# EAGLE design atmega8_bare_bones (EAGLE 5.07)
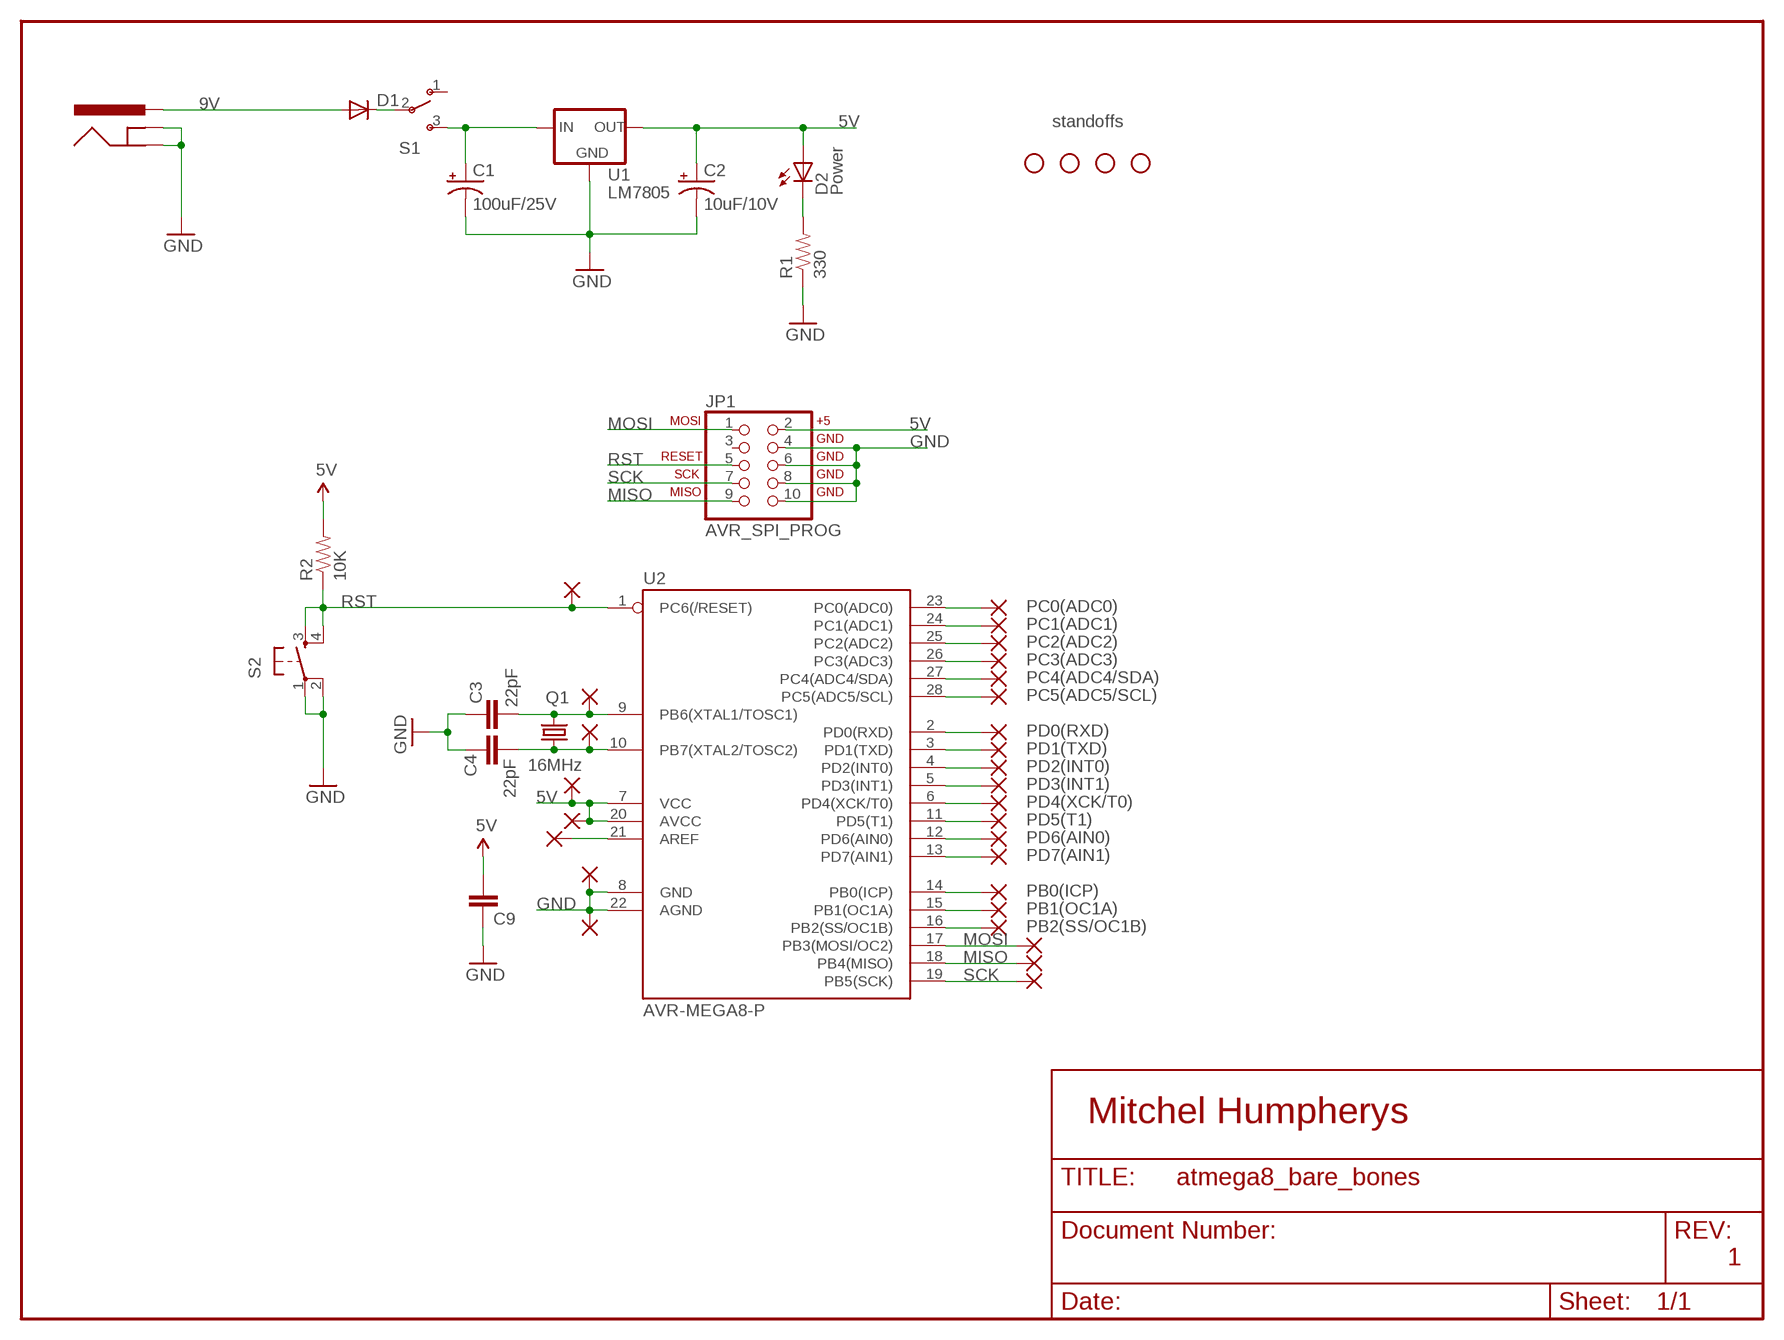
[diagram p0: schematic, sheet 1]

## Parts
C1  100uF/25V  CAP_POLPTH2  [CPOL-RADIAL-10UF-25V]
C2  10uF/10V  CAP_POLPTH2  [CPOL-RADIAL-10UF-25V]
C3  22pF  CAPPTH  [CAP-PTH-SMALL]
C4  22pF  CAPPTH  [CAP-PTH-SMALL]
C9  0.1uF  CAPPTH  [CAP-PTH-SMALL]
D1  DIODEPTH  [DIODE-0.4]
D2  Power  LED5MM  [LED5MM]
JP1  AVR_SPI_PROG  [AVR_ICSP]
JP2  STAND-OFF  [STAND-OFF]
JP3  STAND-OFF  [STAND-OFF]
JP4  STAND-OFF  [STAND-OFF]
JP5  STAND-OFF  [STAND-OFF]
PAD1  2,15/1,0  [2,15/1,0]
PAD2  2,15/1,0  [2,15/1,0]
PAD3  2,15/1,0  [2,15/1,0]
PAD4  2,15/1,0  [2,15/1,0]
PAD5  2,15/1,0  [2,15/1,0]
PAD6  2,15/1,0  [2,15/1,0]
PAD7  2,15/1,0  [2,15/1,0]
PAD8  2,15/1,0  [2,15/1,0]
PAD9  2,15/1,0  [2,15/1,0]
PAD10  2,15/1,0  [2,15/1,0]
PAD18  2,15/1,0  [2,15/1,0]
PB0(ICP)  2,15/1,0  [2,15/1,0]
PB1(OC1A)  2,15/1,0  [2,15/1,0]
PB2(SS/OC1B)  2,15/1,0  [2,15/1,0]
PC0(ADC0)  2,15/1,0  [2,15/1,0]
PC1(ADC1)  2,15/1,0  [2,15/1,0]
PC2(ADC2)  2,15/1,0  [2,15/1,0]
PC3(ADC3)  2,15/1,0  [2,15/1,0]
PC4(ADC4/SDA)  2,15/1,0  [2,15/1,0]
PC5(ADC5/SCL)  2,15/1,0  [2,15/1,0]
PD0(RXD)  2,15/1,0  [2,15/1,0]
PD1(TXD)  2,15/1,0  [2,15/1,0]
PD2(INT0)  2,15/1,0  [2,15/1,0]
PD3(INT1)  2,15/1,0  [2,15/1,0]
PD4(XCK/T0)  2,15/1,0  [2,15/1,0]
PD5(T1)  2,15/1,0  [2,15/1,0]
PD6(AIN0)  2,15/1,0  [2,15/1,0]
PD7(AIN1)  2,15/1,0  [2,15/1,0]
Q1  16MHz  CRYSTALHC49US  [HC49US]
R1  330  RESISTORPTH1  [AXIAL-0.3]
R2  10K  RESISTORPTH1  [AXIAL-0.3]
S1  SWITCH-SPST  [SWITCH-SPST]
S2  Reset  TAC_SWITCHPTH  [TACTILE-PTH]
U1  LM7805  V_REG_78XXSINK  [TO220-IGO]
U2  AVR-MEGA8-P  [DIL28-3]
U$1  POWER_JACKPTH  [POWER_JACK_PTH]
U$2  MITCH_SIG  [MITCH_SIG]

## Nets
5V: C2.1(+) D2.A JP1.2 PAD4.1(P) PAD10.1(P) U1.OUT U2.7(VCC) U2.20(AVCC)
9V: D1.A U$1.PWR
9V2: C1.1(+) S1.3(S) U1.IN
GND: C1.2(-) C2.2(-) C3.1 C4.1 C9.1 JP1.4 JP1.6 JP1.8 JP1.10 PAD5.1(P) PAD6.1(P) R1.P$1 S2.1 S2.2 U1.GND U2.8(GND) U2.22(AGND) U$1.GND U$1.GNDBREAK
MISO: JP1.9 PAD8.1(P) U2.18(PB4(MISO))
MOSI: JP1.1 PAD7.1(P) U2.17(PB3(MOSI/OC2))
N$1: D1.C S1.2(P)
N$2: D2.K(C) R1.P$2
N$3: PC0(ADC0).1(P) U2.23(PC0(ADC0))
N$4: PC1(ADC1).1(P) U2.24(PC1(ADC1))
N$5: C3.2 PAD2.1(P) Q1.2 U2.9(PB6(XTAL1/TOSC1))
N$6: C4.2 PAD3.1(P) Q1.1 U2.10(PB7(XTAL2/TOSC2))
N$7: PC2(ADC2).1(P) U2.25(PC2(ADC2))
N$8: PC3(ADC3).1(P) U2.26(PC3(ADC3))
N$9: PC4(ADC4/SDA).1(P) U2.27(PC4(ADC4/SDA))
N$10: PC5(ADC5/SCL).1(P) U2.28(PC5(ADC5/SCL))
N$11: PD0(RXD).1(P) U2.2(PD0(RXD))
N$12: PD1(TXD).1(P) U2.3(PD1(TXD))
N$13: PD2(INT0).1(P) U2.4(PD2(INT0))
N$14: PD3(INT1).1(P) U2.5(PD3(INT1))
N$15: PD4(XCK/T0).1(P) U2.6(PD4(XCK/T0))
N$16: PD5(T1).1(P) U2.11(PD5(T1))
N$17: PD6(AIN0).1(P) U2.12(PD6(AIN0))
N$18: PD7(AIN1).1(P) U2.13(PD7(AIN1))
N$19: PB0(ICP).1(P) U2.14(PB0(ICP))
N$20: PB1(OC1A).1(P) U2.15(PB1(OC1A))
N$21: PB2(SS/OC1B).1(P) U2.16(PB2(SS/OC1B))
N$22: PAD18.1(P) U2.21(AREF)
RST: JP1.5 PAD1.1(P) R2.P$1 S2.3 S2.4 U2.1(PC6(/RESET))
SCK: JP1.7 PAD9.1(P) U2.19(PB5(SCK))
VCC: C9.2 R2.P$2 ; supply symbol labelled 5V
Unconnected: JP1.3 S1.1(O)

## Notes on the sheet
- standoffs
- 1

## Library data of the parts
C1 C2 = SparkFun:CAP_POL: Capacitor Polarized These are standard SMD and PTH capacitors. Normally 10uF, 47uF, and 100uF in electrolytic and tantalum varieties. Always verify the external diameter of the through hole cap, it varies with capacity, voltage, and manufacturer. The EIA devices should be standard.
C3 C4 C9 = SparkFun:CAP: Capacitor Standard 0603 ceramic capacitor, and 0.1" leaded capacitor.
D1 = SparkFun:DIODE: Diode These are standard reverse protection diodes and small signal diodes. SMA package can handle up to about 1A. SOD-323 can handle about 200mA. What the SOD-323 package when ordering, there are some mfgs out there that are 5-pin packages.
D2 = SparkFun:LED: LEDs Standard schematic elements and footprints for 5mm, 3mm, 1206, and 0603 sized LEDs. 5mm - Spark Fun Electronics SKU : Comp-SBL
JP1 = SparkFun:AVR_SPI_PROG: AVR ICSP Header This is the standard AVR In Circuit Serial Programming header. Minimal, but includes pin one indicator. Works with standard Olimex programmers. Also look for the 6-pin reduced version.
JP2-JP5 = SparkFun:STAND-OFF: Stand Off This is the mechanical footprint for a #4 phillips button head screw. Use the keepout ring to avoid running the screw head into surrounding components. SKU : PRT-00447
PAD1-PAD10 PAD18 PB0(ICP) PB1(OC1A) PB2(SS/OC1B) PC0(ADC0) PC1(ADC1) PC2(ADC2) PC3(ADC3) PC4(ADC4/SDA) PC5(ADC5/SCL) PD0(RXD) PD1(TXD) PD2(INT0) PD3(INT1) PD4(XCK/T0) PD5(T1) PD6(AIN0) PD7(AIN1) = wirepad:2,15/1,0: THROUGH-HOLE PAD
Q1 = SparkFun:CRYSTAL: Crystals Various standard crystals. Proven footprints. Spark Fun Electronics SKU : Comp-XTAL
R1 R2 = SparkFun:RESISTOR: Resistor Basic schematic elements and footprints for 0603, 1206, and PTH 1/10th watt (small) resistors.
S1 = SparkFun:SWITCH-SPST: SPST Switch Simple slide switch. Spark Fun Electronics SKU : Comp-SW1
S2 = SparkFun:TAC_SWITCH: Momentary Switch Button commonly used for reset or general input. Spark Fun Electronics SKU : Comp-PBS
U1 = SparkFun:V_REG_78XX: Voltage Regulator Standard 7805 5V regulator. IGO (Input Ground Output). Spark Fun Electronics SKU : IC-VReg-5V
U2 = SparkFun:AVR-MEGA8-P: MICROCONTROLLER 8 Kbytes FLASH 1 kbytes SRAM 512 bytes EEPROM USART 4-channel 10 bit ADC 2-channel 8 bit ADC
U$1 = SparkFun:POWER_JACK: Power Jack This is the standard 5.5mm barrel jack for power. The PTH is the most common, proven, reliable, footprint. All others are experimental. The Slot footprint only works if the mill layer is transmitted to the PCB fab house so be warned. Spark Fun Electronics SKU : PType-BPJ. Mating wall wart : Tools-PS
U$2 = mitch_feaster:MITCH_SIG: My signature!

## Net classes
0 default: width 0.254 mm
1 power: width 0.508 mm

## Board
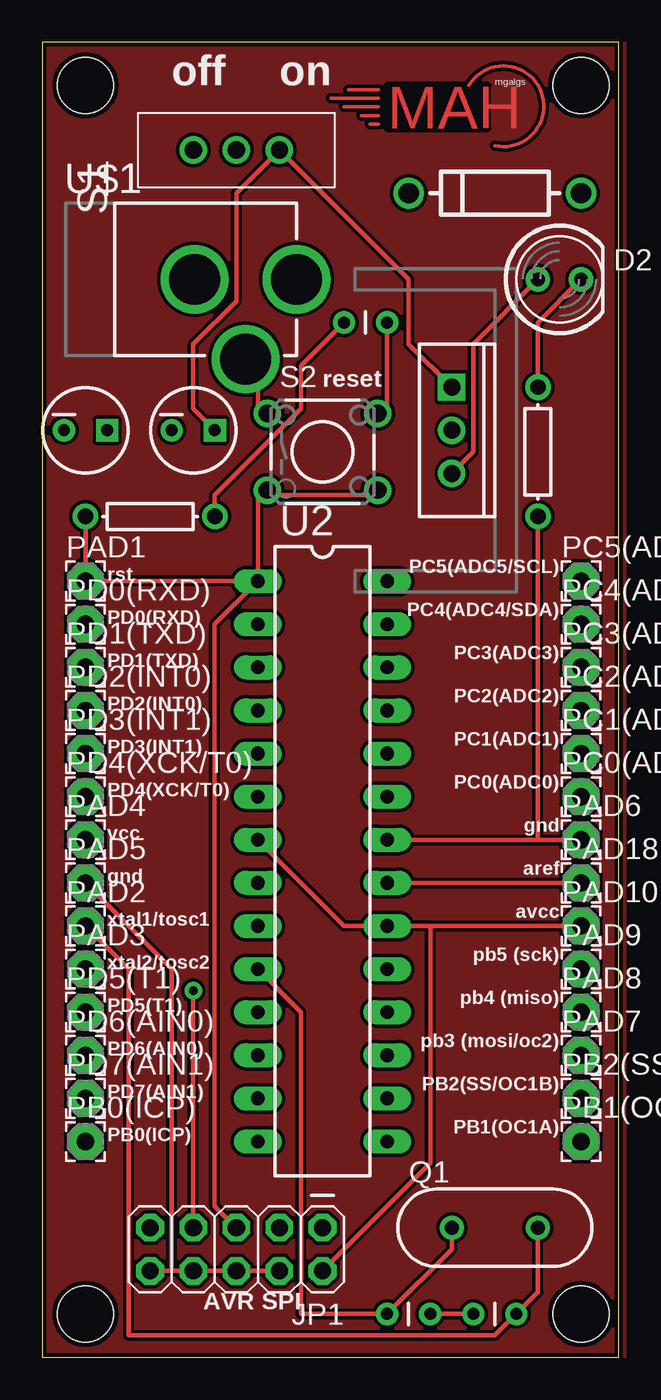
[diagram p1: board, top side]
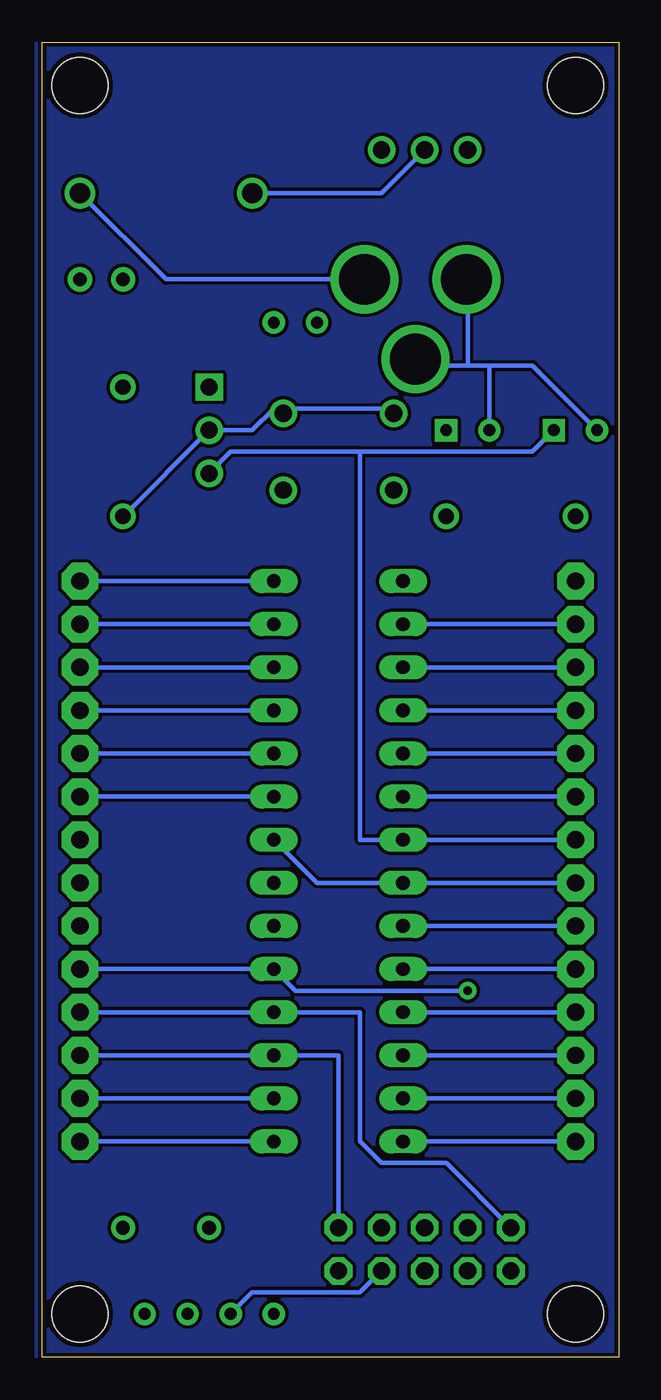
[diagram p2: board, bottom side, seen from below]

Size 33.96 x 77.46 mm. Coordinates in mm from the lower left corner, seen from the top.
Outline: 0,0 33.96,0 33.96,77.46 0,77.46 0,0
Copper layers (1*16): Top 0.035mm / dielectric 1.5mm / Bottom 0.035mm
Design rules "SparkFun": minimum track width 8mil, minimum drill 20mil, track to track 8mil, track to pad 8mil, pad to pad 8mil, via to via 8mil, smd to smd 8mil, copper to edge 10mil, drill to drill 8mil, minimum pad ring 12mil, minimum via ring 10mil, stop-mask expansion 4mil, vias tented up to drill 25mil, thermal gap 10mil

### Footprints (pad centres in the part's own frame; a part is rotated, then mirrored left to right if it is on the bottom)
CPOL-RADIAL-10UF-25V = drill 0.7 square: 1 1.27,0 | drill 0.7 round: 2 -1.27,0
CAP-PTH-SMALL = drill 0.7 round: 1 0,0; 2 2.54,0
DIODE-0.4 = drill 1.2 round: A 0,0; C 10.16,0
LED5MM = drill 0.813 round: A -1.27,0; K 1.27,0
AVR_ICSP = drill 1.016 octagon: 1 -1.27,5.08; 2 1.27,5.08; 3 -1.27,2.54; 4 1.27,2.54; 5 -1.27,0; 6 1.27,0; 7 -1.27,-2.54; 8 1.27,-2.54; 9 -1.27,-5.08; 10 1.27,-5.08
STAND-OFF = hole 3.302: 0,0
2,15/1,0 = drill 1.016 pad 2.159 octagon: 1 0,0
HC49US = drill 0.813 round: 1 -2.54,0; 2 2.54,0
AXIAL-0.3 = drill 0.9 round: P$1 -3.81,0; P$2 3.81,0
SWITCH-SPST = drill 1.016 round: 1 0,2.54; 2 0,0; 3 0,-2.54
TACTILE-PTH = drill 1.016 round: 1 -3.251,2.261; 2 3.251,2.261; 3 -3.251,-2.261; 4 3.251,-2.261
TO220-IGO = drill 1 round: GND 0,0; OUT 2.54,0 | drill 1 square: IN -2.54,0
DIL28-3 = drill 0.813 long: 1 -16.51,-3.81; 2 -13.97,-3.81; 3 -11.43,-3.81; 4 -8.89,-3.81; 5 -6.35,-3.81; 6 -3.81,-3.81; 7 -1.27,-3.81; 8 1.27,-3.81; 9 3.81,-3.81; 10 6.35,-3.81; 11 8.89,-3.81; 12 11.43,-3.81; 13 13.97,-3.81; 14 16.51,-3.81; 15 16.51,3.81; 16 13.97,3.81; 17 11.43,3.81; 18 8.89,3.81; 19 6.35,3.81; 20 3.81,3.81; 21 1.27,3.81; 22 -1.27,3.81; 23 -3.81,3.81; 24 -6.35,3.81; 25 -8.89,3.81; 26 -11.43,3.81; 27 -13.97,3.81; 28 -16.51,3.81
POWER_JACK_PTH = drill 2.997 round: GND 0,7.7; GNDBREAK 4.7,10.7; PWR 0,13.7

### Placement (x,y rotation side)
C1  8.89,54.61 0 top
C2  2.54,54.61 0 top
C3  25.4,2.54 0 top
C4  22.86,2.54 180 top
C9  20.32,60.96 180 top
D1  31.75,68.58 180 top
D2  30.48,63.5 0 top
JP1  11.43,6.35 270 top
JP2  2.54,74.93 0 top
JP3  31.75,74.93 0 top
JP4  2.54,2.54 0 top
JP5  31.75,2.54 0 top
PAD1  2.54,45.72 0 top
PAD2  2.54,25.4 0 top
PAD3  2.54,22.86 0 top
PAD4  2.54,30.48 0 top
PAD5  2.54,27.94 0 top
PAD6  31.75,30.48 0 top
PAD7  31.75,17.78 0 top
PAD8  31.75,20.32 0 top
PAD9  31.75,22.86 0 top
PAD10  31.75,25.4 0 top
PAD18  31.75,27.94 0 top
PB0(ICP)  2.54,12.7 0 top
PB1(OC1A)  31.75,12.7 0 top
PB2(SS/OC1B)  31.75,15.24 0 top
PC0(ADC0)  31.75,33.02 0 top
PC1(ADC1)  31.75,35.56 0 top
PC2(ADC2)  31.75,38.1 0 top
PC3(ADC3)  31.75,40.64 0 top
PC4(ADC4/SDA)  31.75,43.18 0 top
PC5(ADC5/SCL)  31.75,45.72 0 top
PD0(RXD)  2.54,43.18 0 top
PD1(TXD)  2.54,40.64 0 top
PD2(INT0)  2.54,38.1 0 top
PD3(INT1)  2.54,35.56 0 top
PD4(XCK/T0)  2.54,33.02 0 top
PD5(T1)  2.54,20.32 0 top
PD6(AIN0)  2.54,17.78 0 top
PD7(AIN1)  2.54,15.24 0 top
Q1  26.67,7.62 0 top
R1  29.21,53.34 90 top
R2  6.35,49.53 0 top
S1  11.43,71.12 90 top
S2  16.51,53.34 0 top
U1  24.13,54.61 270 top
U2  16.51,29.21 270 top
U$1  1.27,63.5 270 top
U$2  22.86,72.39 0 top

### Tracks (layer width: path | path; a pad name or v marks a point on that pad's centre or on a via)
5V
  Top 0.254: D2.A 25.4,59.69 25.4,53.34 U1.OUT | 22.86,25.4 PAD10.1 | 22.86,25.4 U2.20 17.78,25.4 U2.7 | JP1.2 22.86,11.43 22.86,25.4
  Bottom 0.254: C2.1 5.08,53.34 15.24,53.34 | 15.24,53.34 22.86,53.34 U1.OUT | PAD4.1 U2.7 15.24,30.48 15.24,53.34
9V
  Bottom 0.254: D1.A 26.67,63.5 U$1.PWR
9V2
  Top 0.254: C1.1 8.89,55.88 8.89,59.69 11.43,62.23 11.43,68.58 S1.3 21.59,63.5 21.59,59.69 U1.IN
GND
  Top 0.254: C9.1 20.32,55.88 S2.2 | S2.1 12.7,55.88 12.7,58.42 U$1.GNDBREAK | C4.1 C3.1 | 7.62,5.08 JP1.8 JP1.6 JP1.4 | JP1.10 7.62,5.08 | U2.22 29.21,30.48 | 29.21,30.48 PAD6.1 | 7.62,5.08 7.62,22.86 PAD5.1 | 29.21,30.48 R1.P$1
  Bottom 0.254: R1.P$1 U1.GND 21.59,54.61 20.32,55.88 S2.2 19.05,55.88 13.97,55.88 S2.1 | C2.2 5.08,58.42 7.62,58.42 | 8.89,58.42 11.43,58.42 U$1.GNDBREAK | 8.89,58.42 7.62,58.42 | 7.62,58.42 C1.2 | 8.89,58.42 8.89,63.5 U$1.GND | C4.1 21.59,3.81 15.24,3.81 JP1.4 | PAD5.1 U2.8 17.78,27.94 U2.22
MISO
  Bottom 0.254: PAD8.1 U2.18 15.24,20.32 15.24,12.7 13.97,11.43 10.16,11.43 JP1.9
MOSI
  Bottom 0.254: PAD7.1 U2.17 16.51,17.78 JP1.1
N$1
  Bottom 0.254: S1.2 13.97,68.58 D1.C
N$2
  Top 0.254: D2.K 29.21,60.96 R1.P$2
N$3
  Bottom 0.254: U2.23 PC0(ADC0).1
N$4
  Bottom 0.254: U2.24 PC1(ADC1).1
N$5
  Top 0.254: Q1.2 29.21,3.81 C3.2 26.67,1.27 5.08,1.27 5.08,22.86 PAD2.1
  Bottom 0.254: PAD2.1 U2.9
N$6
  Top 0.254: Q1.1 24.13,6.35 C4.2 15.24,2.54 15.24,20.32 U2.10
  Bottom 0.254: U2.10 PAD3.1
N$7
  Bottom 0.254: U2.25 PC2(ADC2).1
N$8
  Bottom 0.254: U2.26 PC3(ADC3).1
N$9
  Bottom 0.254: U2.27 PC4(ADC4/SDA).1
N$10
  Bottom 0.254: U2.28 PC5(ADC5/SCL).1
N$11
  Bottom 0.254: PD0(RXD).1 U2.2
N$12
  Bottom 0.254: PD1(TXD).1 U2.3
N$13
  Bottom 0.254: PD2(INT0).1 U2.4
N$14
  Bottom 0.254: PD3(INT1).1 U2.5
N$15
  Bottom 0.254: PD4(XCK/T0).1 U2.6
N$16
  Bottom 0.254: PD5(T1).1 U2.11
N$17
  Bottom 0.254: PD6(AIN0).1 U2.12
N$18
  Bottom 0.254: PD7(AIN1).1 U2.13
N$19
  Bottom 0.254: PB0(ICP).1 U2.14
N$20
  Bottom 0.254: U2.15 PB1(OC1A).1
N$21
  Bottom 0.254: U2.16 PB2(SS/OC1B).1
N$22
  Top 0.254: U2.21 PAD18.1
N$23
  pour Top: 0,77.47 0,0 34.29,0 34.29,77.47
N$24
  pour Bottom: 0,77.47 0,0 34.29,0 34.29,77.47
RST
  Top 0.254: R2.P$1 PAD1.1 U2.1 | U2.1 12.7,50.8 S2.3 13.97,50.8 19.05,50.8 S2.4 | JP1.5 10.16,8.89 10.16,43.18 U2.1
SCK  (via drill 0.51)
  Top 0.254: JP1.7 v8.89,21.59
  Bottom 0.254: PAD9.1 U2.19 19.05,21.59 v8.89,21.59
VCC
  Top 0.254: C9.2 15.24,58.42 15.24,55.88 10.16,50.8 R2.P$2

### Text on the board
tPlace: off | on | reset | PC5(ADC5/SCL) | rst | PC4(ADC4/SDA) | PD0(RXD) | PC3(ADC3) | PD1(TXD) | PC2(ADC2) | PD2(INT0) | PC1(ADC1) | PD3(INT1) | PC0(ADC0) | PD4(XCK/T0) | gnd | vcc | aref | gnd | avcc | xtal1/tosc1 | pb5 (sck) | xtal2/tosc2 | pb4 (miso) | PD5(T1) | pb3 (mosi/oc2) | PD6(AIN0) | PB2(SS/OC1B) | PD7(AIN1) | PB1(OC1A) | PB0(ICP) | AVR SPI